# EAGLE design CP2102N-Breakout_v10 (EAGLE 7.7.0)
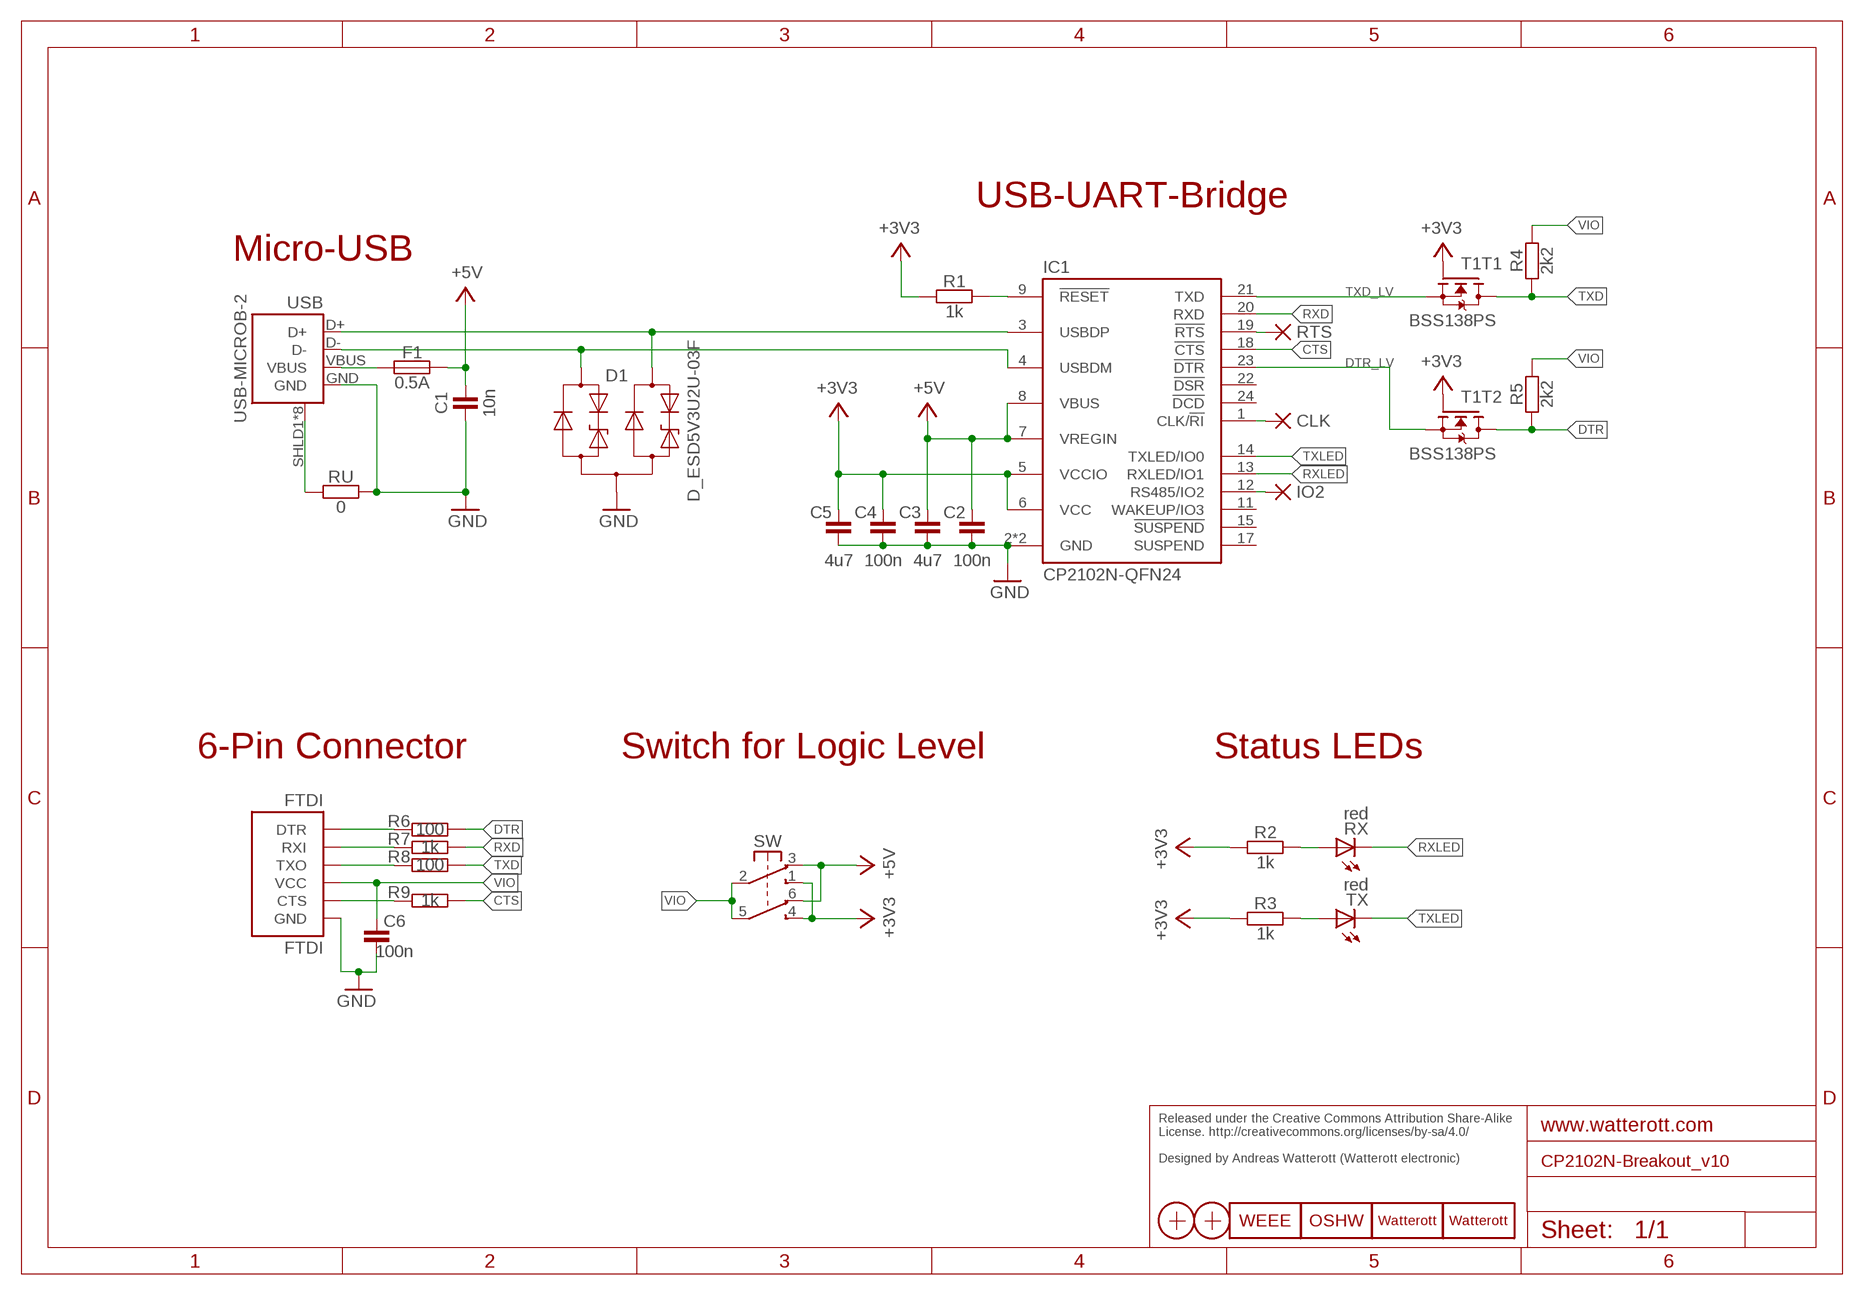
[diagram p0: schematic, sheet 1]

## Parts
C1  10n  CAPACITOR-0402  [C0402]
C2  100n  CAPACITOR-0402  [C0402]
C3  4u7  CAPACITOR-0603  [C0603]
C4  100n  CAPACITOR-0402  [C0402]
C5  4u7  CAPACITOR-0603  [C0603]
C6  100n  CAPACITOR-0402  [C0402]
CLK  PAD-0.5_NC  [PAD-0.5_NC]
D1  D_ESD5V3U2U-03F  [SOT723]
F1  0.5A  FUSE-0805  [C0805]
FTDI  FTDI  [FTDI]
IC1  CP2102N-QFN24  [QFN24-PAD]
IO2  PAD-0.5_NC  [PAD-0.5_NC]
LOGO1  WEEE_LOGO-S  [WEEE_TPLAC_S]
LOGO2  OSHW_LOGOX0070  [OSHW_6X70]
LOGO3  LOGO-S_PLACE_S  [SPARK_TPLACE_S]
LOGO4  LOGO-S_PLACE_M  [SPARK_TPLACE_M]
R1  1k  RESISTOR-0402  [C0402]
R2  1k  RESISTOR-0402  [C0402]
R3  1k  RESISTOR-0402  [C0402]
R4  2k2  RESISTOR-0402  [C0402]
R5  2k2  RESISTOR-0402  [C0402]
R6  100  RESISTOR-0402  [C0402]
R7  1k  RESISTOR-0402  [C0402]
R8  100  RESISTOR-0402  [C0402]
R9  1k  RESISTOR-0402  [C0402]
RTS  PAD-0.5_NC  [PAD-0.5_NC]
RU  0  RESISTOR-0402  [C0402]
RX  red  LED-0603  [C0603]
SW  SW-2UM-CUS22B  [CUS22B]
T1  BSS138PS  [SOT363]
TX  red  LED-0603  [C0603]
USB  USB-MICROB-2  [USB-MICROB-10118194]
X1  PASSER-07  [PASSER_07MM]
X2  PASSER-07  [PASSER_07MM]

## Nets
+3V3: C4.2 C5.2 IC1.5(VCCIO) IC1.6(VCC) R1.1 R2.1 R3.1 SW.1(S1) SW.4(S2) T1.2(T1:G) T1.5(T2:G)
+5V: C1.2 C2.2 C3.2 F1.2 IC1.7(VREGIN) IC1.8(VBUS) SW.3(O1) SW.6(O2)
CLK: CLK.1(P) IC1.1(CLK/!RI)
CTS: IC1.18(!CTS) R9.1
CTSI: FTDI.2-CTS(CTS) R9.2
D_N: D1.1(C1) IC1.4(USBDM) USB.D-
D_P: D1.2(C2) IC1.3(USBDP) USB.D+
DTR: R5.1 R6.1 T1.3(T2:D)
DTR_LV: IC1.23(!DTR) T1.4(T2:S)
DTRO: FTDI.6-DTR(DTR) R6.2
GND: C1.1 C2.1 C3.1 C4.1 C5.1 C6.1 D1.3(A) FTDI.1-GND(GND) IC1.2(GND) IC1.TP(GND) RU.2 USB.GND
IO2: IC1.12(RS485/IO2) IO2.1(P)
RESET: IC1.9(!RESET) R1.2
RTS: IC1.19(!RTS) RTS.1(P)
RX-LED: R2.2 RX.A
RXD: IC1.20(RXD) R7.1
RXI: FTDI.5-RXI(RXI) R7.2
RXLED: IC1.13(RXLED/IO1) RX.C
SHLD: RU.1 USB.SHLD1(SHIELD) USB.SHLD2(SHIELD) USB.SHLD3(SHIELD) USB.SHLD4(SHIELD) USB.SHLD5(SHIELD) USB.SHLD6(SHIELD) USB.SHLD7(SHIELD) USB.SHLD8(SHIELD)
TX-LED: R3.2 TX.A
TXD: R4.1 R8.1 T1.6(T1:D)
TXD_LV: IC1.21(TXD) T1.1(T1:S)
TXLED: IC1.14(TXLED/IO0) TX.C
TXO: FTDI.4-TXO(TXO) R8.2
VBUS: F1.1 USB.VBUS
VIO: C6.2 FTDI.3-VCC(VCC) R4.2 R5.2 SW.2(P1) SW.5(P2)
Unconnected: IC1.11(WAKEUP/IO3) IC1.15(!SUSPEND) IC1.17(SUSPEND) IC1.22(!DSR) IC1.24(!DCD)

## Notes on the sheet
- USB-UART-Bridge
- Micro-USB
- 6-Pin Connector | Switch for Logic Level | Status LEDs
- Released under the Creative Commons Attribution Share-Alike 
  License. http://creativecommons.org/licenses/by-sa/4.0/
  
  Designed by Andreas Watterott (Watterott electronic)

## Library data of the parts
C1-C6 = we-rcl:CAPACITOR: Capacitors ...2.2uF @ 6.3V -> 0402 ...4.7uF @ 6.3V -> 0603 ...10uF @ 16V -> 0805 ...22uF @ 25V -> 1206
CLK IO2 RTS = we-rcl:PAD: Pads and Test-Points
D1 = we-rcl:D_ESD5V3U2U: TVS Diode - Uni-directional Ultra Low ESD / Transient Protection Diode Vrwm=5.3V, 0.4pF@1MHz; DIGIKEY: ESD5V3U2U-03F H6327DKR-ND
F1 = we-rcl:FUSE: Fuses
FTDI = we-board:FTDI: FTDI 6pol connector
IC1 = we-chip:CP2102N: Silabs CP2102N USB to UART Bridge (5V tolerant inputs) CP2102N-QFN24 is pin-compatible with CP2104.
LOGO1 = we-symbol:WEEE_LOGO: WEEE Logo
LOGO2 = we-symbol:OSHW_LOGO: Open-Source-Hardware Logo
LOGO3 LOGO4 = we-symbol:LOGO: Watterott electronic Logo
R1-R9 RU = we-rcl:RESISTOR: Resistors all kinds in 0402 and 0603
RX TX = we-opto:LED: LEDs red, green, blue -> 0603
SW = we-switch:SW-2UM: Switch; DIGIKEY: 563-1105-6-ND
T1 = we-transistor:BSS138PS: Dual N-Channel MOSFET BSS138 (Vgs>=+/-20V, Vds>=40V, Id>=0.2A + Rds<=3Ohm @ Vgs=4.5V)
USB = we-con:USB: USB Connectors; DIGIKEY: 609-4618-6-ND
X1 X2 = we-symbol:PASSER: Fiducial Markers

## Board
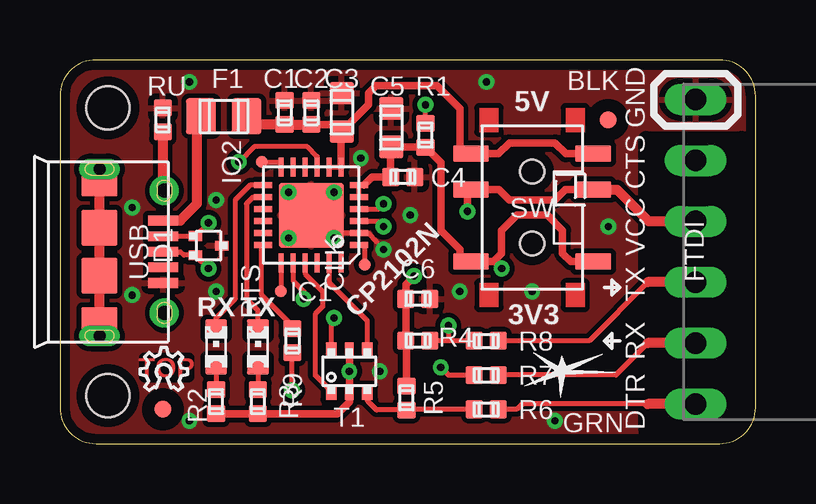
[diagram p1: board, top side]
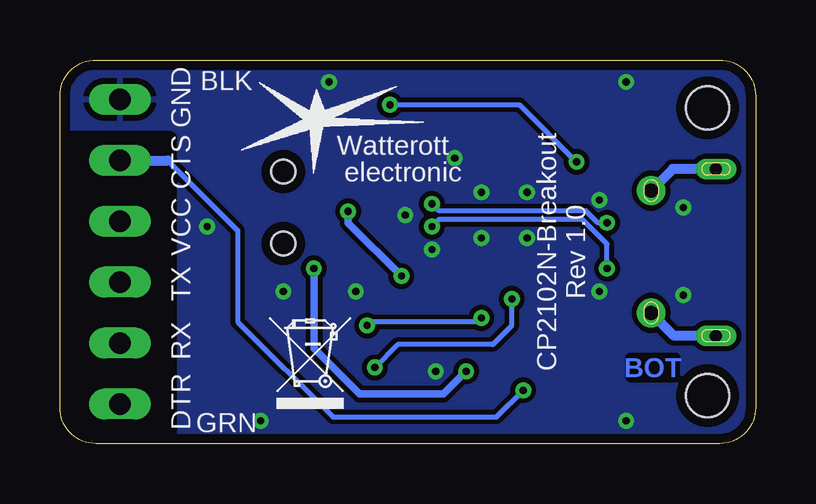
[diagram p2: board, bottom side, seen from below]

Size 29 x 16 mm. Coordinates in mm from the lower left corner, seen from the top.
Outline: 0,1.5 arc90 1.5,0 27.5,0 arc90 29,1.5 29,14.5 arc90 27.5,16 1.5,16 arc90 0,14.5 0,1.5
Copper layers (1*16): Top 0.035mm / dielectric 1.5mm / Bottom 0.035mm
Design rules "we-dru-2-layer *": minimum track width 0.15mm, minimum drill 0.3mm, track to track 0.15mm, track to pad 0.15mm, pad to pad 0.15mm, via to via 0.15mm, smd to smd 0.1mm, copper to edge 0.4mm, drill to drill 0.2mm, minimum pad ring 0.18mm, minimum via ring 0.18mm, stop-mask expansion 0.1mm, vias tented up to drill 0.5mm, thermal gap 0.25mm
Holes 1.8 mm at 2,14 2,2
tRestrict: area 24.4,0.6 to 28.4,12.7
bRestrict: area 24.4,0.6 to 28.4,12.7

### Footprints (pad centres in the part's own frame; a part is rotated, then mirrored left to right if it is on the bottom)
C0402 = smd 0.75 x 0.7: 1 0,0.5; 2 0,-0.5
C0603 = smd 1 x 0.95: 1 0,0.8; 2 0,-0.8
PAD-0.5_NC = smd 0.5 x 0.5: 1 0,0
SOT723 = smd 0.6 x 0.4: 1 -0.55,0.4; 2 -0.55,-0.4; 3 0.55,0
C0805 = smd 1.5 x 1.25: 1 0,0.95; 2 0,-0.95
FTDI = drill 0.9 pad 1.3 long: 1-GND 0,6.35; 2-CTS 0,3.81; 3-VCC 0,1.27; 4-TXO 0,-1.27; 5-RXI 0,-3.81; 6-DTR 0,-6.35
QFN24-PAD = smd 0.8 x 0.26: 1 -2,1.25; 2 -2,0.75; 3 -2,0.25; 4 -2,-0.25; 5 -2,-0.75; 6 -2,-1.25; 13 2,-1.25; 14 2,-0.75; 15 2,-0.25; 16 2,0.25; 17 2,0.75; 18 2,1.25 | smd 0.26 x 0.8: 7 -1.25,-2; 8 -0.75,-2; 9 -0.25,-2; 10 0.25,-2; 11 0.75,-2; 12 1.25,-2; 19 1.25,2; 20 0.75,2; 21 0.25,2; 22 -0.25,2; 23 -0.75,2; 24 -1.25,2 | smd 2.7 x 2.7: TP 0,0
C0603' = smd 0.9 x 0.8: A 0,-0.75; C 0,0.75
CUS22B = smd 0.7 x 1.5: 1 -2.25,2.55; 2 0.75,2.55; 3 2.25,2.55; 4 -2.25,-2.55; 5 0.75,-2.55; 6 2.25,-2.55 | hole 1: -1.5,0; 1.5,0
SOT363 = smd 0.6 x 0.5: 1 -0.9,0.75; 3 -0.9,-0.75; 4 0.9,-0.75; 6 0.9,0.75 | smd 0.6 x 0.4: 2 -0.9,0; 5 0.9,0
USB-MICROB-10118194 = smd 1.3 x 0.4: D+ -2.5,0; D- -2.5,-0.65; GND -2.5,1.3; ID -2.5,0.65; VBUS -2.5,-1.3 | drill 0.6 pad 1.2: SHLD1 -2.55,2.55; SHLD2 -2.55,-2.55 | drill 0.5 pad 0.8 long: SHLD3 0.15,3.5; SHLD4 0.15,-3.45 | smd 1.5 x 1.1: SHLD5 0.15,2.85; SHLD6 0.15,-2.85 | smd 1.5 x 1.5: SHLD7 0.15,1; SHLD8 0.15,-1
PASSER_07MM = smd 0.7 x 0.7: X 0,0

### Placement (x,y rotation side)
C1  9.37,13.81 0 top
C2  10.48,13.81 0 top
C3  11.75,13.81 0 top
C4  14.29,11.11 270 top
C5  13.81,13.18 0 top
C6  14.92,6.03 270 top
CLK  12.7,7.46 0 top
D1  6.19,8.26 0 top
F1  6.83,13.65 90 top
FTDI  26.5,8 0 top
IC1  10.48,9.53 180 top
IO2  8.41,11.75 0 top
LOGO1  18.57,3.81 0 bottom
LOGO2  3.33,2.22 0 top
LOGO3  20.95,3.02 0 top
LOGO4  18.26,13.49 0 bottom
R1  15.24,12.86 180 top
R2  6.51,1.75 180 top
R3  8.26,1.75 180 top
R4  14.92,4.29 270 top
R5  14.45,1.91 180 top
R6  17.78,1.43 90 top
R7  17.78,2.86 90 top
R8  17.78,4.29 90 top
R9  9.68,4.29 0 top
RTS  9.21,6.35 0 top
RU  4.29,13.49 180 top
RX  red  [C0603']  6.51,4.03 0 top
SW  19.68,9.84 90 top
T1  12.06,3.02 90 top
TX  red  [C0603']  8.26,4.03 0 top
USB  1.8,8 180 top
X1  4.29,1.43 0 top
X2  22.86,13.49 0 top

### Tracks (layer width: path | path; a pad name or v marks a point on that pad's centre or on a via)
+3V3  (via drill 0.3)
  Top 0.203: 12.68,10.78 IC1.6 IC1.5 | 13.79,12.35 C5.2 13.83,12.36 | SW.1 16.86,7.59 16.67,7.78
  Top 0.305: R2.1 R3.1 11.56,1.25 12.06,1.75 T1.2 v12.06,3.02 T1.5 | 12.68,10.78 13.02,11.11 C4.2 13.79,12.35 | 13.83,12.36 R1.1 15.88,11.72 15.88,8.89 16.67,8.1 16.67,7.78 | SW.4 21.3,7.59 20.95,7.94 20.95,8.89 20.32,9.53 19.05,9.53 18.41,8.89 18.41,7.94 18.07,7.59 | SW.1 18.07,7.59 | 18.07,7.59 18.12,7.59 v18.41,7.3
  Bottom 0.305: v12.06,3.02 13.02,2.06 16.51,2.06 18.41,3.97 v18.41,7.3
+5V
  Top 0.203: IC1.8 IC1.7 | C3.2 | SW.3 16.8,12.09 16.67,12.22
  Top 0.305: C2.2 11.45,13.31 C3.2 11.73,12.99 IC1.7 | C3.2 12.86,14.13 12.86,14.61 13.18,14.92 15.72,14.92 16.67,13.97 16.67,12.22 | SW.3 18.28,12.09 18.73,12.54 20.64,12.54 21.09,12.09 SW.6
  Top 0.406: F1.2 8.12,13.31 C1.2 C2.2
CLK
  Top 0.203: IC1.1 12.7,8.28 CLK.1
CTS
  Top 0.203: R9.1 9.68,4.92 8.41,6.19 8.41,8.26 8.43,8.28 IC1.18
CTSI  (via drill 0.3)
  Top 0.203: v9.68,2.22 R9.2
  Bottom 0.203: 24.51,11.81 21.59,8.89 21.59,5.08 17.62,1.11 10.79,1.11 v9.68,2.22
  Bottom 0.406: FTDI.2-CTS 24.51,11.81
D_N  (via drill 0.3)
  Top 0.16: D1.1
  Top 0.203: IC1.4 13.27,9.78 v13.49,10 | USB.D- D1.1 | D1.1 v6.19,9.21
  Bottom 0.203: v6.19,9.21 6.58,9.21 7.07,9.7 13.19,9.7 v13.49,10
D_P  (via drill 0.3)
  Top 0.203: IC1.3 13.27,9.28 v13.49,9.05 | USB.D+ 5.02,8 5.16,7.86 D1.2 v6.19,7.3
  Bottom 0.203: v6.19,7.3 6.19,8.32 7.22,9.35 13.19,9.35 v13.49,9.05
DTR
  Top 0.203: R6.1 14.47,1.43 R5.1 13.2,1.41 12.81,1.79 T1.3
DTR_LV
  Top 0.203: T1.4 12.81,5.12 11.23,6.71 IC1.23
DTRO
  Top 0.203: 24.51,1.65 19.27,1.65 19.05,1.43 R6.2
  Top 0.406: FTDI.6-DTR 24.51,1.65
GND  (via drill 0.3)
  Top 0.203: IC1.TP 11.23,8.78 IC1.2 12.85,8.78 13.21,8.41
  other vias: 12.54,11.91 9.53,10.48 11.43,10.48 9.53,8.57 11.43,8.57 13.49,8.1 6.51,10.16 6.51,6.35 20.64,0.95 19.68,6.35 5.4,15.08 17.78,15.08 3.02,6.19 3.02,9.84 13.34,3.02 5.4,0.95 22.86,9.05 14.61,9.53 16.67,6.35
  pour Top (isolate 0.203, rank 2): 0,16 29,16 29,0 0,0
  pour Bottom (isolate 0.203): 0,16 29,16 29,0 0,0
IO2
  Top 0.203: IO2.1 9.23,11.75 IC1.12
RESET  (via drill 0.3)
  Top 0.203: IC1.9 10.73,11.97 10.32,12.38 8.1,12.38 v7.46,11.75 | R1.2 v15.24,14.13
  Bottom 0.203: v15.24,14.13 9.84,14.13 v7.46,11.75
RTS
  Top 0.203: IC1.19 9.23,6.37 RTS.1
RX-LED
  Top 0.203: RX.A R2.2
RXD  (via drill 0.3)
  Top 0.203: v15.88,3.17 16.19,2.86 R7.1 | IC1.20 9.73,6.78 10.16,6.35 v10.16,6.03
  Bottom 0.203: v15.88,3.17 14.92,4.13 10.95,4.13 10.16,4.92 v10.16,6.03
RXI
  Top 0.203: 24.51,4.19 23.18,2.86 R7.2
  Top 0.406: FTDI.5-RXI 24.51,4.19
RXLED
  Top 0.203: IC1.13 7.92,10.78 7.3,10.16 7.3,6.03 6.51,5.24 RX.C
SHLD
  Top 0.406: RU.1 4.29,10.61 USB.SHLD2 | USB.SHLD3 USB.SHLD5 USB.SHLD7 USB.SHLD8 USB.SHLD6 USB.SHLD4
  Bottom 0.406: USB.SHLD4 3.45,11.45 USB.SHLD2 | USB.SHLD3 3.4,4.5 USB.SHLD1
TX-LED
  Top 0.203: TX.A R3.2
TXD  (via drill 0.3)
  Top 0.203: R8.1 16.19,4.29 | 16.19,4.29 R4.1 | v16.19,4.92 16.19,4.29 | T1.6 11.31,5.12 v11.43,5.24
  Bottom 0.203: v11.43,5.24 11.59,5.08 16.03,5.08 v16.19,4.92
TXD_LV
  Top 0.203: IC1.21 10.23,7.08 10.95,6.35 10.95,5.71 10.64,5.4 10.64,2.86 11.31,2.18 T1.1
TXLED
  Top 0.203: IC1.14 8.05,10.28 7.78,10 7.78,6.03 8.26,5.56 TX.C
TXO
  Top 0.203: 24.51,6.73 22.07,4.29 R8.2
  Top 0.406: FTDI.4-TXO 24.51,6.73
VBUS
  Top 0.203: 5.71,13.49 F1.1
  Top 0.406: USB.VBUS 5.01,9.3 5.71,10 5.71,13.49
VIO  (via drill 0.3)
  Top 0.203: 14.45,4.26 R4.2 | SW.2 17.1,10.59 16.99,10.48
  Top 0.305: SW.2 18.3,10.59 18.73,10.16 20.64,10.16 21.07,10.59 SW.5 | R5.2 14.45,4.26 | R4.2 C6.2 14.42,6.64 v14.76,6.99 | 16.99,10.48 v16.99,9.68
  Top 0.406: FTDI.3-VCC 24.54,9.27 23.22,10.59 SW.5
  Bottom 0.305: v16.99,9.68 16.99,9.21 v14.76,6.99

### Text on the board
Top: TOP
Bottom: BOT
tPlace: BLK | 5V | GND | CTS | VCC | CP2102N | TX | 3V3 | RX | DTR | GRN
bPlace: BLK | GND | Watterott | electronic | CTS | VCC | CP2102N-Breakout / Rev 1.0 | TX | RX | DTR | GRN
Reference: Silkscreen: 21 tPlace + 22 bPlace